# Altium schematic sheet Down.SchDoc
size Legal; SheetNumber: 1; SheetTotal: 8
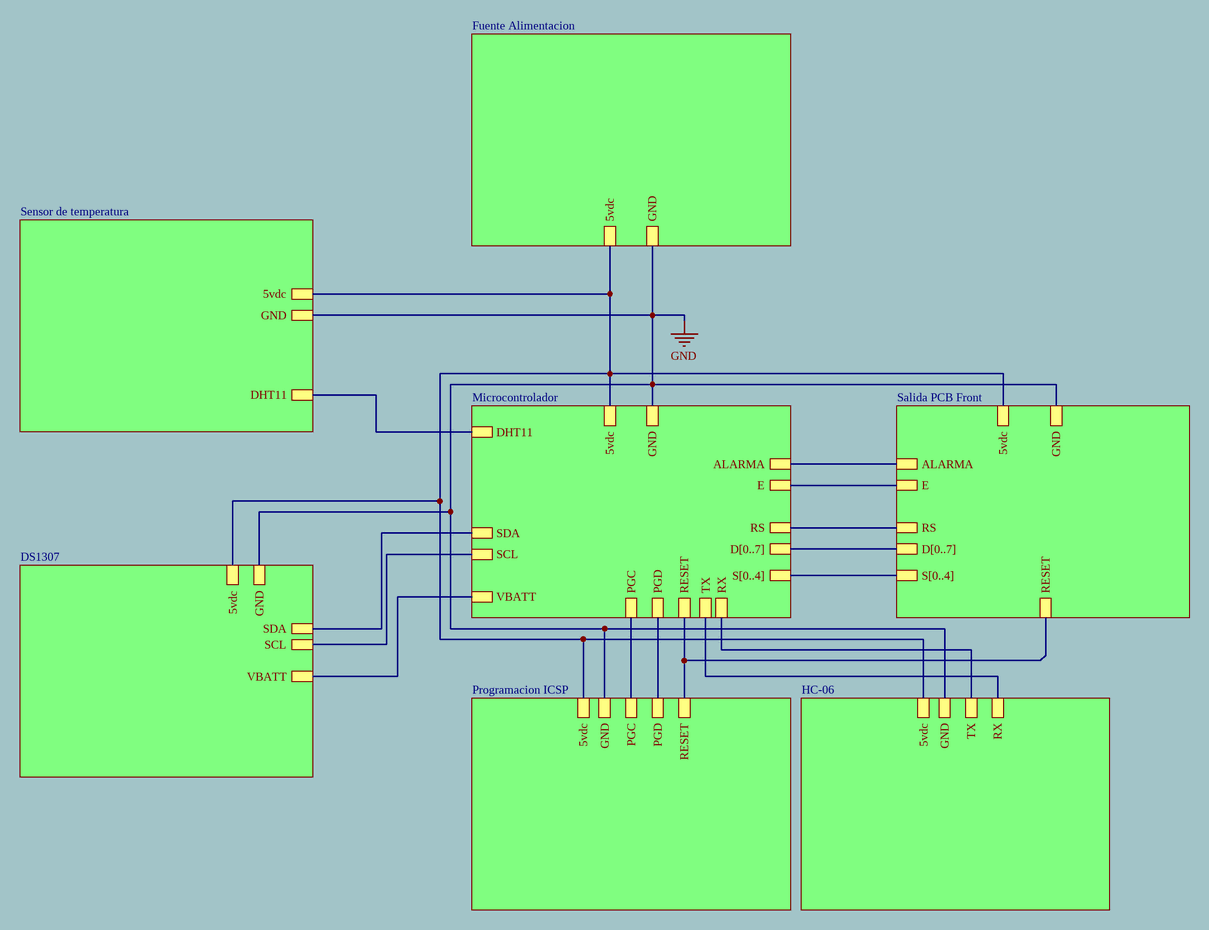
[diagram p0: Down.SchDoc]

## Sub-sheets
DS1307 = DS1307: GND, 5vdc, SDA, SCL, VBATT
Fuente Alimentacion = Fuente Alimentacion: 5vdc, GND
HC-06 = HC-06: 5vdc, GND, TX, RX
Microcontrolador = Microcontrolador: 5vdc, GND, RESET, S[0..4], PGD, PGC, VBATT, D[0..7], RS, E, SCL, SDA, ALARMA, DHT11, TX, RX
Programacion ICSP = Programacion ICSP: PGC, PGD, RESET, 5vdc, GND
Salida PCB Front = Salida PCB Front: S[0..4], D[0..7], RS, E, ALARMA, 5vdc, GND, RESET
Sensor de temperatura = Sensor de temperatura: DHT11, 5vdc, GND

## Nets
GND: sheet Fuente Alimentacion/GND, sheet Microcontrolador/GND, sheet Programacion ICSP/GND, sheet Salida PCB Front/GND, sheet Sensor de temperatura/GND, sheet DS1307/GND, sheet HC-06/GND
(unnamed): sheet Fuente Alimentacion/5vdc, sheet Microcontrolador/5vdc, sheet Programacion ICSP/5vdc, sheet Salida PCB Front/5vdc, sheet Sensor de temperatura/5vdc, sheet DS1307/5vdc, sheet HC-06/5vdc
(unnamed): sheet Microcontrolador/RESET, sheet Programacion ICSP/RESET, sheet Salida PCB Front/RESET
(unnamed): sheet Microcontrolador/PGD, sheet Programacion ICSP/PGD
(unnamed): sheet Microcontrolador/PGC, sheet Programacion ICSP/PGC
(unnamed): sheet Microcontrolador/VBATT, sheet DS1307/VBATT
(unnamed): sheet Microcontrolador/RS, sheet Salida PCB Front/RS
(unnamed): sheet Microcontrolador/E, sheet Salida PCB Front/E
(unnamed): sheet Microcontrolador/SCL, sheet DS1307/SCL
(unnamed): sheet Microcontrolador/SDA, sheet DS1307/SDA
(unnamed): sheet Microcontrolador/ALARMA, sheet Salida PCB Front/ALARMA
(unnamed): sheet Microcontrolador/DHT11, sheet Sensor de temperatura/DHT11
(unnamed): sheet Microcontrolador/TX, sheet HC-06/RX
(unnamed): sheet Microcontrolador/RX, sheet HC-06/TX

## Buses and harness runs
bus sheet Microcontrolador/D[0..7] = sheet Salida PCB Front/D[0..7]
bus sheet Microcontrolador/S[0..4] = sheet Salida PCB Front/S[0..4]